# EAGLE schematic QCopter (EAGLE 7.1.0)
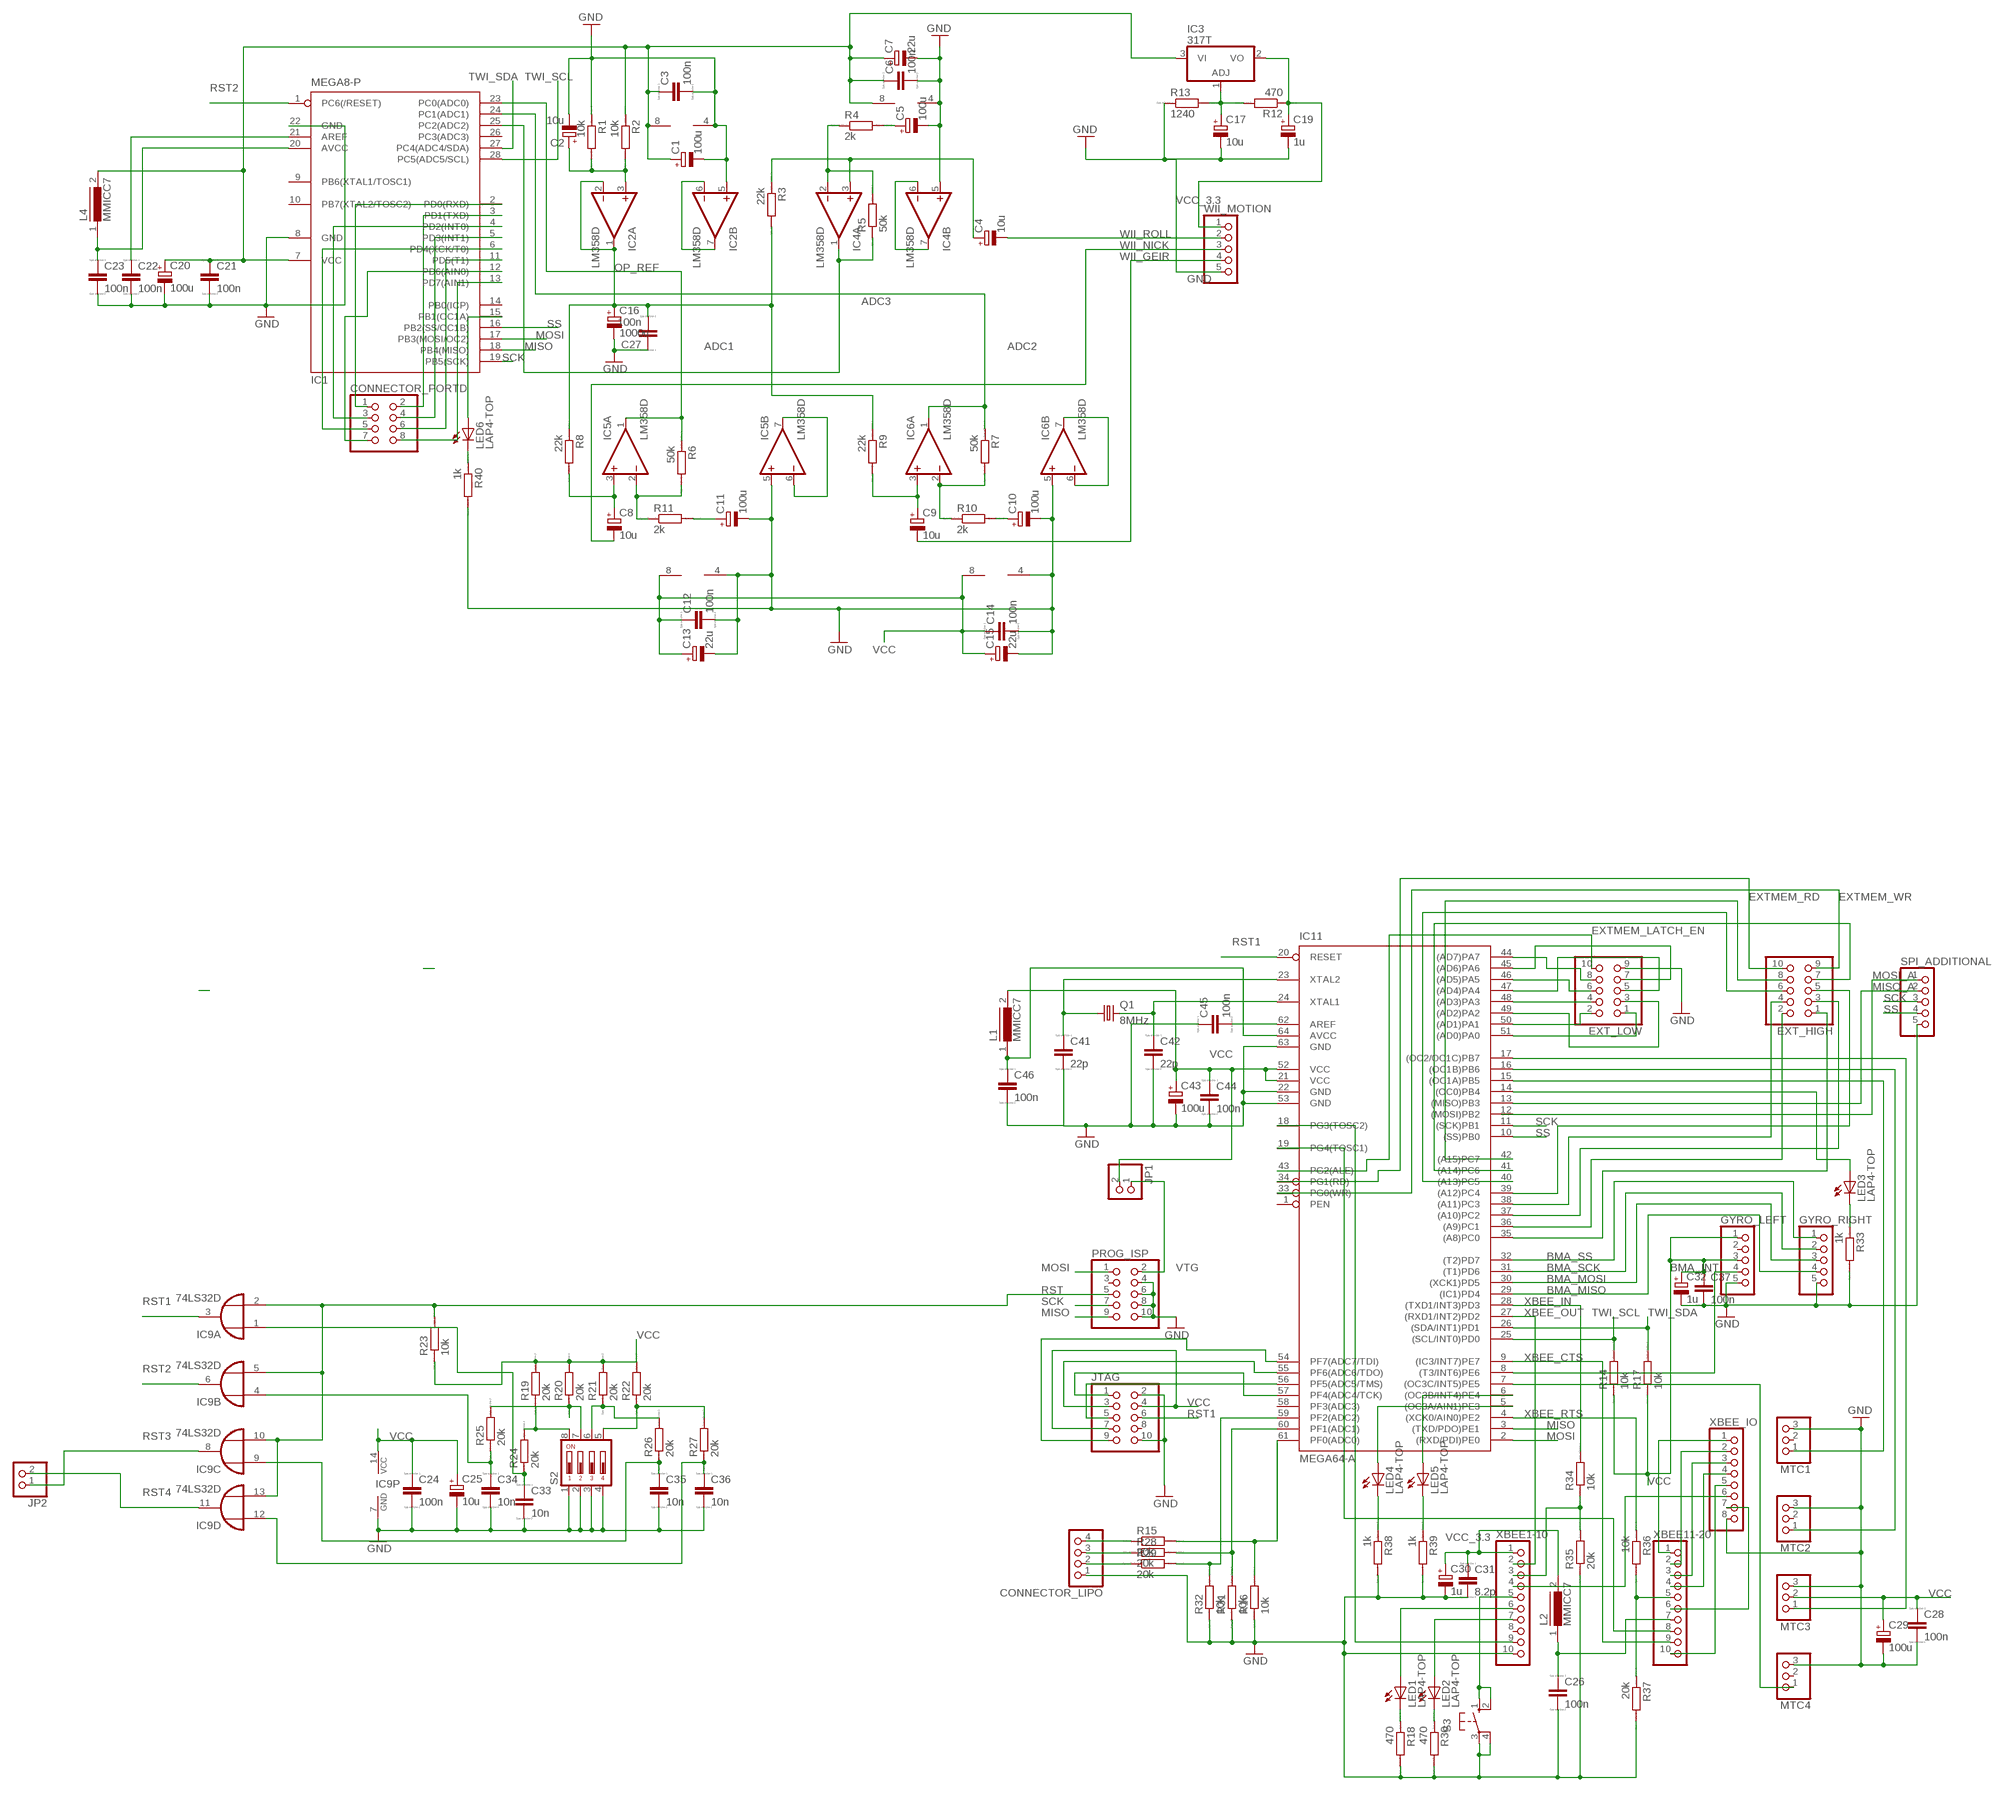
[diagram p0: schematic, sheet 1]

## Parts
C1  100u  CPOL-EU153CLV-0505  [153CLV-0505]
C2  10u  CPOL-EU153CLV-0505  [153CLV-0505]
C3  100n  C-EUC0805K  [C0805K]
C4  10u  CPOL-EU153CLV-0505  [153CLV-0505]
C5  100u  CPOL-EU153CLV-0505  [153CLV-0505]
C6  100n  C-EUC0805K  [C0805K]
C7  22u  CPOL-EU153CLV-0505  [153CLV-0505]
C8  10u  CPOL-EU153CLV-0505  [153CLV-0505]
C9  10u  CPOL-EU153CLV-0505  [153CLV-0505]
C10  100u  CPOL-EU153CLV-0505  [153CLV-0505]
C11  100u  CPOL-EU153CLV-0505  [153CLV-0505]
C12  100n  C-EUC0805K  [C0805K]
C13  22u  CPOL-EU153CLV-0505  [153CLV-0505]
C14  100n  C-EUC0805K  [C0805K]
C15  22u  CPOL-EU153CLV-0505  [153CLV-0505]
C16  1000u  CPOL-EUE3.5-10  [E3,5-10]
C17  10u  CPOL-EUE5-6  [E5-6]
C19  1u  CPOL-EUE5-6  [E5-6]
C20  100u  CPOL-EUE5-6  [E5-6]
C21  100n  C-EU025-025X050  [C025-025X050]
C22  100n  C-EU025-025X050  [C025-025X050]
C23  100n  C-EU025-025X050  [C025-025X050]
C24  100n  C-EUC0805K  [C0805K]
C25  10u  CPOL-EU153CLV-0505  [153CLV-0505]
C26  100n  C-EUC0805K  [C0805K]
C27  100n  C-EUC0805K  [C0805K]
C28  100n  C-EUC0805K  [C0805K]
C29  100u  CPOL-EU153CLV-0605  [153CLV-0605]
C30  1u  CPOL-EU153CLV-0605  [153CLV-0605]
C31  8.2p  C-EU025-024X044  [C025-024X044]
C32  1u  CPOL-EU153CLV-0605  [153CLV-0605]
C33  10n  C-EUC0805K  [C0805K]
C34  10n  C-EUC0805K  [C0805K]
C35  10n  C-EUC0805K  [C0805K]
C36  10n  C-EUC0805K  [C0805K]
C37  100n  C-EUC0805K  [C0805K]
C41  22p  C-EU025-025X050  [C025-025X050]
C42  22p  C-EU025-025X050  [C025-025X050]
C43  100u  CPOL-EU153CLV-0605  [153CLV-0605]
C44  100n  C-EUC0805K  [C0805K]
C45  100n  C-EUC0805K  [C0805K]
C46  100n  C-EUC0805K  [C0805K]
CONNECTOR_LIPO  PINHD-1X4  [1X04]
CONNECTOR_PORTD  PINHD-2X4  [2X04]
EXT_HIGH  PINHD-2X5  [2X05]
EXT_LOW  PINHD-2X5  [2X05]
GYRO_LEFT  PINHD-1X5  [1X05]
GYRO_RIGHT  PINHD-1X5  [1X05]
IC1  MEGA8-P  [DIL28-3]
IC2  LM358D  [SO08]
IC3  317T  [TO220H]
IC4  LM358D  [SO08]
IC5  LM358D  [SO08]
IC6  LM358D  [SO08]
IC9  74LS32D  [SO14]
IC11  MEGA64-A  [TQFP64]
JP1  PINHD-1X2  [1X02]
JP2  PINHD-1X2  [1X02]
JTAG  PINHD-2X5  [2X05]
L1  MMICC7  [MMICC7]
L2  MMICC7  [MMICC7]
L4  MMICC7  [MMICC7]
LED1  LAP4-TOP  [P47F-TOP]
LED2  LAP4-TOP  [P47F-TOP]
LED3  LAP4-TOP  [P47F-TOP]
LED4  LAP4-TOP  [P47F-TOP]
LED5  LAP4-TOP  [P47F-TOP]
LED6  LAP4-TOP  [P47F-TOP]
MTC1  PINHD-1X3  [1X03]
MTC2  PINHD-1X3  [1X03]
MTC3  PINHD-1X3  [1X03]
MTC4  PINHD-1X3  [1X03]
PROG_ISP  PINHD-2X5  [2X05]
Q1  8MHz  CRYSTALHC49S  [HC49/S]
R1  10k  R-EU_R1206  [R1206]
R2  10k  R-EU_R1206  [R1206]
R3  22k  R-EU_R1206  [R1206]
R4  2k  R-EU_R1206  [R1206]
R5  50k  R-EU_R1206  [R1206]
R6  50k  R-EU_R1206  [R1206]
R7  50k  R-EU_R1206  [R1206]
R8  22k  R-EU_R1206  [R1206]
R9  22k  R-EU_R1206  [R1206]
R10  2k  R-EU_R1206  [R1206]
R11  2k  R-EU_R1206  [R1206]
R12  470  R-EU_0414_15  [0414/15]
R13  1240  R-EU_0414_15  [0414/15]
R14  10k  R-EU_R1206  [R1206]
R15  20k  R-EU_R1206  [R1206]
R16  10k  R-EU_R1206  [R1206]
R17  10k  R-EU_R1206  [R1206]
R18  470  R-EU_R1206  [R1206]
R19  20k  R-EU_R1206  [R1206]
R20  20k  R-EU_R1206  [R1206]
R21  20k  R-EU_R1206  [R1206]
R22  20k  R-EU_R1206  [R1206]
R23  10k  R-EU_R1206  [R1206]
R24  20k  R-EU_R1206  [R1206]
R25  20k  R-EU_R1206  [R1206]
R26  20k  R-EU_R1206  [R1206]
R27  20k  R-EU_R1206W  [R1206W]
R28  20k  R-EU_R1206  [R1206]
R29  20k  R-EU_R1206  [R1206]
R30  470  R-EU_R1206  [R1206]
R31  10k  R-EU_R1206  [R1206]
R32  10k  R-EU_R1206  [R1206]
R33  1k  R-EU_R1206  [R1206]
R34  10k  R-EU_R1206  [R1206]
R35  20k  R-EU_R1206  [R1206]
R36  10k  R-EU_R1206  [R1206]
R37  20k  R-EU_R1206  [R1206]
R38  1k  R-EU_R1206  [R1206]
R39  1k  R-EU_R1206  [R1206]
R40  1k  R-EU_R1206  [R1206]
S2  DS04  [DS-04]
S3  10-XX  [B3F-10XX]
SPI_ADDITIONAL  PINHD-1X5  [1X05]
WII_MOTION  PINHD-1X5  [1X05]
XBEE1-10  PINHD-1X10M  [1X10M]
XBEE11-20  PINHD-1X10M  [1X10M]
XBEE_IO  PINHD-1X8  [1X08]

## Nets
ADC1: IC1.23(PC0(ADC0)) IC5.1(A:OUT) R6.1
ADC2: IC1.24(PC1(ADC1)) IC6.1(A:OUT) R7.1
ADC3: IC1.25(PC2(ADC2)) IC4.1(A:OUT) R5.1
BMA_INT: GYRO_LEFT.4 IC11.8((T3/INT6)PE6)
BMA_MISO: GYRO_RIGHT.4 IC11.29((IC1)PD4)
BMA_MOSI: GYRO_RIGHT.3 IC11.30((XCK1)PD5)
BMA_SCK: GYRO_RIGHT.2 IC11.31((T1)PD6)
BMA_SS: GYRO_RIGHT.1 IC11.32((T2)PD7)
EXT_LOW: EXT_LOW.1 IC11.51((AD0)PA0)
EXTMEM_LATCH_EN: EXT_LOW.10 IC11.43(PG2(ALE))
EXTMEM_RD: EXT_HIGH.10 IC11.34(PG1(RD))
EXTMEM_WR: EXT_HIGH.9 IC11.33(PG0(WR))
GND: C1.- C2.- C3.2 C5.- C6.2 C7.- C10.- C11.- C12.2 C13.- C14.2 C15.- C16.- C17.- C19.- C20.- C21.2 C22.2 C23.2 C24.2 C25.- C26.2 C27.1 C28.2 C29.- C30.- C31.2 C32.- C33.2 C34.2 C35.2 C36.2 C37.2 C41.2 C42.2 C43.- C44.2 C45.1 C46.2 CONNECTOR_LIPO.1 EXT_LOW.9 GYRO_LEFT.5 GYRO_RIGHT.5 IC1.8(GND) IC1.22(GND) IC2.4(P:V-) IC2.5(B:+IN) IC4.4(P:V-) IC4.5(B:+IN) IC5.4(P:V-) IC5.5(B:+IN) IC6.4(P:V-) IC6.5(B:+IN) IC9.7(P:GND) IC11.22(GND) IC11.53(GND) IC11.63(GND) JTAG.2 JTAG.10 MTC1.3 MTC2.3 MTC3.3 MTC4.3 PROG_ISP.4 PROG_ISP.6 PROG_ISP.8 PROG_ISP.10 R1.1 R13.1 R16.1 R18.2 R30.2 R31.1 R32.1 R33.2 R35.1 R37.2 R38.2 R39.2 R40.2 S2.1 S2.2 S2.3 S2.4 S3.3(P) S3.4(P1) SPI_ADDITIONAL.5 WII_MOTION.5 XBEE1-10.10 XBEE_IO.8
MISO: IC1.18(PB4(MISO)) IC11.3((TXD/PDO)PE1) PROG_ISP.9
MISO_A: IC11.13((MISO)PB3) SPI_ADDITIONAL.2
MOSI: IC1.17(PB3(MOSI/OC2)) IC11.2((RXD/PDI)PE0) PROG_ISP.1
MOSI_A: SPI_ADDITIONAL.1
N$1: C2.+ IC2.3(A:+IN) R1.2 R2.2
N$2: IC2.6(B:-IN) IC2.7(B:OUT)
N$3: IC4.6(B:-IN) IC4.7(B:OUT)
N$4: C4.+ IC4.3(A:+IN) R3.1
N$5: IC11.15((OC1A)PB5) MTC1.1
N$6: IC11.16((OC1B)PB6) MTC2.1
N$7: C5.+ R4.2
N$8: IC4.2(A:-IN) R4.1 R5.2
N$9: IC5.2(A:-IN) R6.2 R11.1
N$10: CONNECTOR_PORTD.1 IC1.2(PD0(RXD))
N$11: IC6.2(A:-IN) R7.2 R10.1
N$12: C17.+ IC3.1(ADJ) R12.2 R13.2
N$13: IC5.6(B:-IN) IC5.7(B:OUT)
N$14: IC6.6(B:-IN) IC6.7(B:OUT)
N$15: C11.+ R11.2
N$16: C22.1 IC1.21(AREF)
N$17: C8.+ IC5.3(A:+IN) R8.2
N$18: C9.+ IC6.3(A:+IN) R9.2
N$19: C41.1 IC11.23(XTAL2) Q1.1
N$20: C42.1 IC11.24(XTAL1) Q1.2
N$21: C10.+ R10.2
N$22: C23.1 IC1.20(AVCC) L4.1
N$23: CONNECTOR_PORTD.2 IC1.3(PD1(TXD))
N$24: IC11.17((OC2/OC1C)PB7) MTC3.1
N$25: IC11.7((OC3C/INT5)PE5) MTC4.1
N$27: CONNECTOR_PORTD.3 IC1.4(PD2(INT0))
N$28: CONNECTOR_PORTD.4 IC1.5(PD3(INT1))
N$29: CONNECTOR_PORTD.5 IC1.6(PD4(XCK/T0))
N$30: CONNECTOR_PORTD.6 IC1.11(PD5(T1))
N$31: CONNECTOR_PORTD.7 IC1.12(PD6(AIN0))
N$32: CONNECTOR_PORTD.8 IC1.13(PD7(AIN1))
N$34: CONNECTOR_LIPO.4 R15.1
N$35: LED1.C R18.1
N$36: LED2.C R30.1
N$37: C26.1 L2.1 XBEE11-20.7
N$38: C45.2 IC11.62(AREF)
N$39: LED1.A XBEE1-10.6
N$40: IC11.61(PF0(ADC0)) R15.2 R16.2
N$41: LED2.A XBEE1-10.7
N$42: C46.1 IC11.64(AVCC) L1.1
N$43: XBEE11-20.1 XBEE_IO.1
N$44: S3.1(S) S3.2(S1) XBEE1-10.5
N$45: XBEE11-20.2 XBEE_IO.2
N$46: CONNECTOR_LIPO.3 R28.1
N$47: XBEE11-20.3 XBEE_IO.3
N$48: XBEE11-20.4 XBEE_IO.4
N$49: IC11.14((OC0)PB4) LED3.A
N$50: LED3.C R33.1
N$51: EXT_HIGH.1 IC11.35((A8)PC0)
N$52: CONNECTOR_LIPO.2 R29.1
N$53: R19.1 R24.2 S2.8
N$54: R21.1 R26.2 S2.6
N$55: C35.1 IC9.9(C:I0) R26.1
N$56: C36.1 IC9.12(D:I0) R27.1
N$57: R20.1 R25.2 S2.7
N$58: C33.1 IC9.1(A:I0) R24.1
N$59: C34.1 IC9.4(B:I0) R25.1
N$60: R22.1 R27.2 S2.5
N$61: XBEE11-20.10 XBEE_IO.5
N$62: IC11.60(PF1(ADC1)) R28.2 R31.2
N$63: IC11.59(PF2(ADC2)) R29.2 R32.2
N$64: EXT_LOW.2 IC11.50((AD1)PA1)
N$65: EXT_LOW.3 IC11.49((AD2)PA2)
N$66: EXT_LOW.4 IC11.48((AD3)PA3)
N$67: EXT_LOW.5 IC11.47((AD4)PA4)
N$68: EXT_LOW.6 IC11.46((AD5)PA5)
N$69: EXT_LOW.7 IC11.45((AD6)PA6)
N$70: EXT_LOW.8 IC11.44((AD7)PA7)
N$71: EXT_HIGH.2 IC11.36((A9)PC1)
N$72: EXT_HIGH.3 IC11.37((A10)PC2)
N$73: EXT_HIGH.4 IC11.38((A11)PC3)
N$74: EXT_HIGH.5 IC11.39((A12)PC4)
N$75: EXT_HIGH.6 IC11.40((A13)PC5)
N$76: EXT_HIGH.7 IC11.41((A14)PC6)
N$77: EXT_HIGH.8 IC11.42((A15)PC7)
N$78: IC11.18(PG3(TOSC2)) XBEE1-10.9
N$79: IC11.19(PG4(TOSC1)) XBEE11-20.8
N$80: XBEE1-10.4 XBEE_IO.6
N$81: XBEE11-20.6 XBEE_IO.7
N$82: R34.1 R35.2 XBEE1-10.3
N$83: IC11.57(PF4(ADC4/TCK)) JTAG.1
N$84: R36.2 R37.1 XBEE11-20.5
N$85: IC11.55(PF6(ADC6/TDO)) JTAG.3
N$86: IC11.56(PF5(ADC5/TMS)) JTAG.5
N$87: LED6.C R40.1
N$88: IC11.54(PF7(ADC7/TDI)) JTAG.9
N$89: LED4.C R38.1
N$90: LED5.C R39.1
N$91: IC11.5((OC3A/AIN1)PE3) LED4.A
N$92: IC11.6((OC3B/INT4)PE4) LED5.A
N$93: IC1.15(PB1(OC1A)) LED6.A
OP_REF: C16.+ C27.2 IC2.1(A:OUT) IC2.2(A:-IN) R3.2 R8.1 R9.1
RST: IC9.2(A:I1) IC9.5(B:I1) IC9.10(C:I1) IC9.13(D:I1) PROG_ISP.5 R23.2
RST1: IC9.3(A:O) IC11.20(RESET) JTAG.6
RST2: IC1.1(PC6(/RESET)) IC9.6(B:O)
RST3: IC9.8(C:O) JP2.1
RST4: IC9.11(D:O) JP2.2
SCK: IC1.19(PB5(SCK)) IC11.11((SCK)PB1) PROG_ISP.7 SPI_ADDITIONAL.3
SS: IC1.16(PB2(SS/OC1B)) IC11.10((SS)PB0) SPI_ADDITIONAL.4
TWI_SCL: IC1.28(PC5(ADC5/SCL)) IC11.25((SCL/INT0)PD0) R14.2
TWI_SDA: IC1.27(PC4(ADC4/SDA)) IC11.26((SDA/INT1)PD1) R17.2
VCC: C1.+ C3.1 C6.1 C7.+ C12.1 C13.+ C14.1 C15.+ C20.+ C21.1 C24.1 C25.+ C28.1 C29.+ C32.+ C37.1 C43.+ C44.1 GYRO_LEFT.1 GYRO_LEFT.3 IC1.7(VCC) IC2.8(P:V+) IC3.3(VI) IC4.8(P:V+) IC5.8(P:V+) IC6.8(P:V+) IC9.14(P:VCC) IC11.21(VCC) IC11.52(VCC) JP1.2 JTAG.4 JTAG.7 L1.2 L4.2 MTC3.2 R2.1 R14.1 R17.1 R19.2 R20.2 R21.2 R22.2 R23.1
VCC_3.3: C19.+ C30.+ C31.1 IC3.2(VO) L2.2 R12.1 WII_MOTION.1 XBEE1-10.1
VTG: JP1.1 PROG_ISP.2
WII_GEIR: C9.- WII_MOTION.4
WII_NICK: C8.- WII_MOTION.3
WII_ROLL: C4.- WII_MOTION.2
XBEE_CTS: IC11.9((IC3/INT7)PE7) XBEE11-20.9
XBEE_IN: IC11.28((TXD1/INT3)PD3) R34.2
XBEE_OUT: IC11.27((RXD1/INT2)PD2) XBEE1-10.2
XBEE_RTS: IC11.4((XCK0/AIN0)PE2) R36.1
Unconnected: GYRO_LEFT.2 IC1.9(PB6(XTAL1/TOSC1)) IC1.10(PB7(XTAL2/TOSC2)) IC1.14(PB0(ICP)) IC1.26(PC3(ADC3)) IC11.1(PEN) IC11.12((MOSI)PB2) IC11.58(PF3(ADC3)) JTAG.8 MTC1.2 MTC2.2 MTC4.2 PROG_ISP.3 XBEE1-10.8

## Library data of the parts
C1 C2 C4 C5 C7-C11 C13 C15-C17 C19 C20 C25 C29 C30 C32 C43 = resistor:CPOL-EU: POLARIZED CAPACITOR, European symbol
C3 C6 C12 C14 C21-C24 C26-C28 C31 C33-C37 C41 C42 C44-C46 = resistor:C-EU: CAPACITOR, European symbol; SPICEPREFIX: C
CONNECTOR_LIPO = pinhead:PINHD-1X4: PIN HEADER
CONNECTOR_PORTD = pinhead:PINHD-2X4: PIN HEADER
EXT_HIGH EXT_LOW JTAG PROG_ISP = pinhead:PINHD-2X5: PIN HEADER
GYRO_LEFT GYRO_RIGHT SPI_ADDITIONAL WII_MOTION = pinhead:PINHD-1X5: PIN HEADER
IC1 = atmel:MEGA8-P: MICROCONTROLLER 8 Kbytes FLASH, 1 kbytes SRAM, 512 bytes EEPROM, USART, 4-channel 10 bit ADC, 2-channel 8 bit ADC Pin compatible with Atmega48, ATMega88, ATMega168 Source: avr.lbr; OC_FARNELL: unknown; OC_NEWARK: unknown
IC2 IC4-IC6 = linear:LM358: OP AMP also LM158; LM258; LM2904 Source: http://cache.national.com/ds/LM/LM158.pdf
IC3 = linear:*317: Positive VOLTAGE REGULATOR
IC9 = 74xx-eu:74*32: Quad 2-input OR gate
IC11 = atmel:MEGA64: MICROCONTROLLER 64 Kbytes FLASH 4 Kbytes SRAM 2 Kbytes EEPROM DUAL USART 8-channel 10 bit ADC Source: avr.lbr; MPN: ATMEGA64-16AU; OC_FARNELL: 9171355; OC_NEWARK: 01M6899
JP1 JP2 = pinhead:PINHD-1X2: PIN HEADER
L1 L2 L4 = inductors:MMICC7: INDUCTOR
LED1-LED6 = led:*P4: PointLED® Enhanced Thinfilm LED TOP & BOTTOM mount LS P47F, LR P47F, LA P47F, LY P47F, LT P4SG, LB P4SG, LW P4SG Source: http://catalog.osram-os.com .. LA_LR_LS_LY_P47F_Pb_free.pdf
MTC1-MTC4 = pinhead:PINHD-1X3: PIN HEADER
Q1 = crystal:CRYSTAL: CRYSTAL; OC_FARNELL: 1667008; OC_NEWARK: unknown
R1-R40 = resistor:R-EU_: RESISTOR, European symbol; SPICEPREFIX: R
S2 = switch-dil:DS04: DIL/CODE SWITCH; OC_FARNELL: 9471570; OC_NEWARK: unknown
S3 = switch-omron:10-XX: OMRON SWITCH; MPN: B3F-1000; OC_FARNELL: 176432; OC_NEWARK: 36M3542
XBEE1-10 XBEE11-20 = pinhead:PINHD-1X10: PIN HEADER
XBEE_IO = pinhead:PINHD-1X8: PIN HEADER